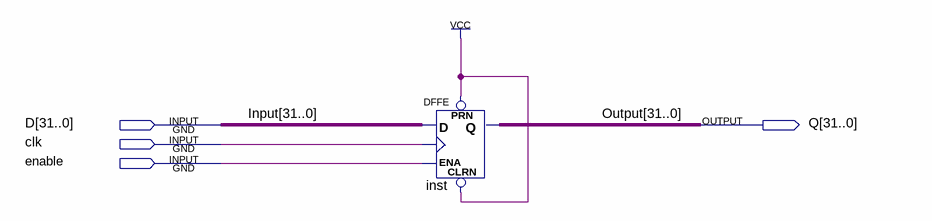
[diagram p0: schematic sheet]
// Quartus schematic Reg32.bdf as structural Verilog: 1 symbols, 4 pins
module Reg32 (
  input  [31:0] D,
  input  clk,
  input  enable,
  output [31:0] Q
);

  DFFE inst[31:0] (.PRN(1'b1), .CLRN(1'b1), .D(D), .CLK(clk), .ENA(enable), .Q(Q));

  // Other names for the same wires on the sheet: Input[31:0] = D; Output[31:0] = Q
endmodule
